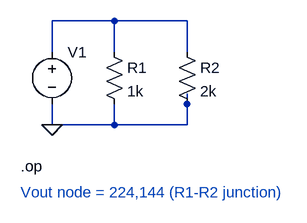
[diagram p0: schematic 01_voltage_divider.asc]
01_voltage_divider.asc, the LTspice schematic file:
Version 4
SHEET 1 880 680
WIRE 224 96 128 96
WIRE 336 96 224 96
WIRE 128 144 128 96
WIRE 224 144 224 96
WIRE 336 144 336 96
WIRE 128 256 128 224
WIRE 224 256 224 224
WIRE 224 256 128 256
WIRE 336 256 336 208
WIRE 336 256 224 256
FLAG 128 256 0
SYMBOL voltage 128 128 R0
WINDOW 3 -60 40 Invisible 2
SYMATTR InstName V1
SYMATTR Value 12
SYMBOL res 208 128 R0
SYMATTR InstName R1
SYMATTR Value 1k
SYMBOL res 320 128 R0
SYMATTR InstName R2
SYMATTR Value 2k
TEXT 80 320 Left 2 !.op
TEXT 80 360 Left 2 ;Vout node = 224,144 (R1-R2 junction)

The netlist it stands for:
* 01_voltage_divider.asc
V1 N001 0 12
R1 N001 0 1k
R2 N001 0 2k
.op
* Vout node = 224,144 (R1-R2 junction)
.backanno
.end